# EAGLE design McPiFace-Pi4-V1.0 (EAGLE 7.4.0)
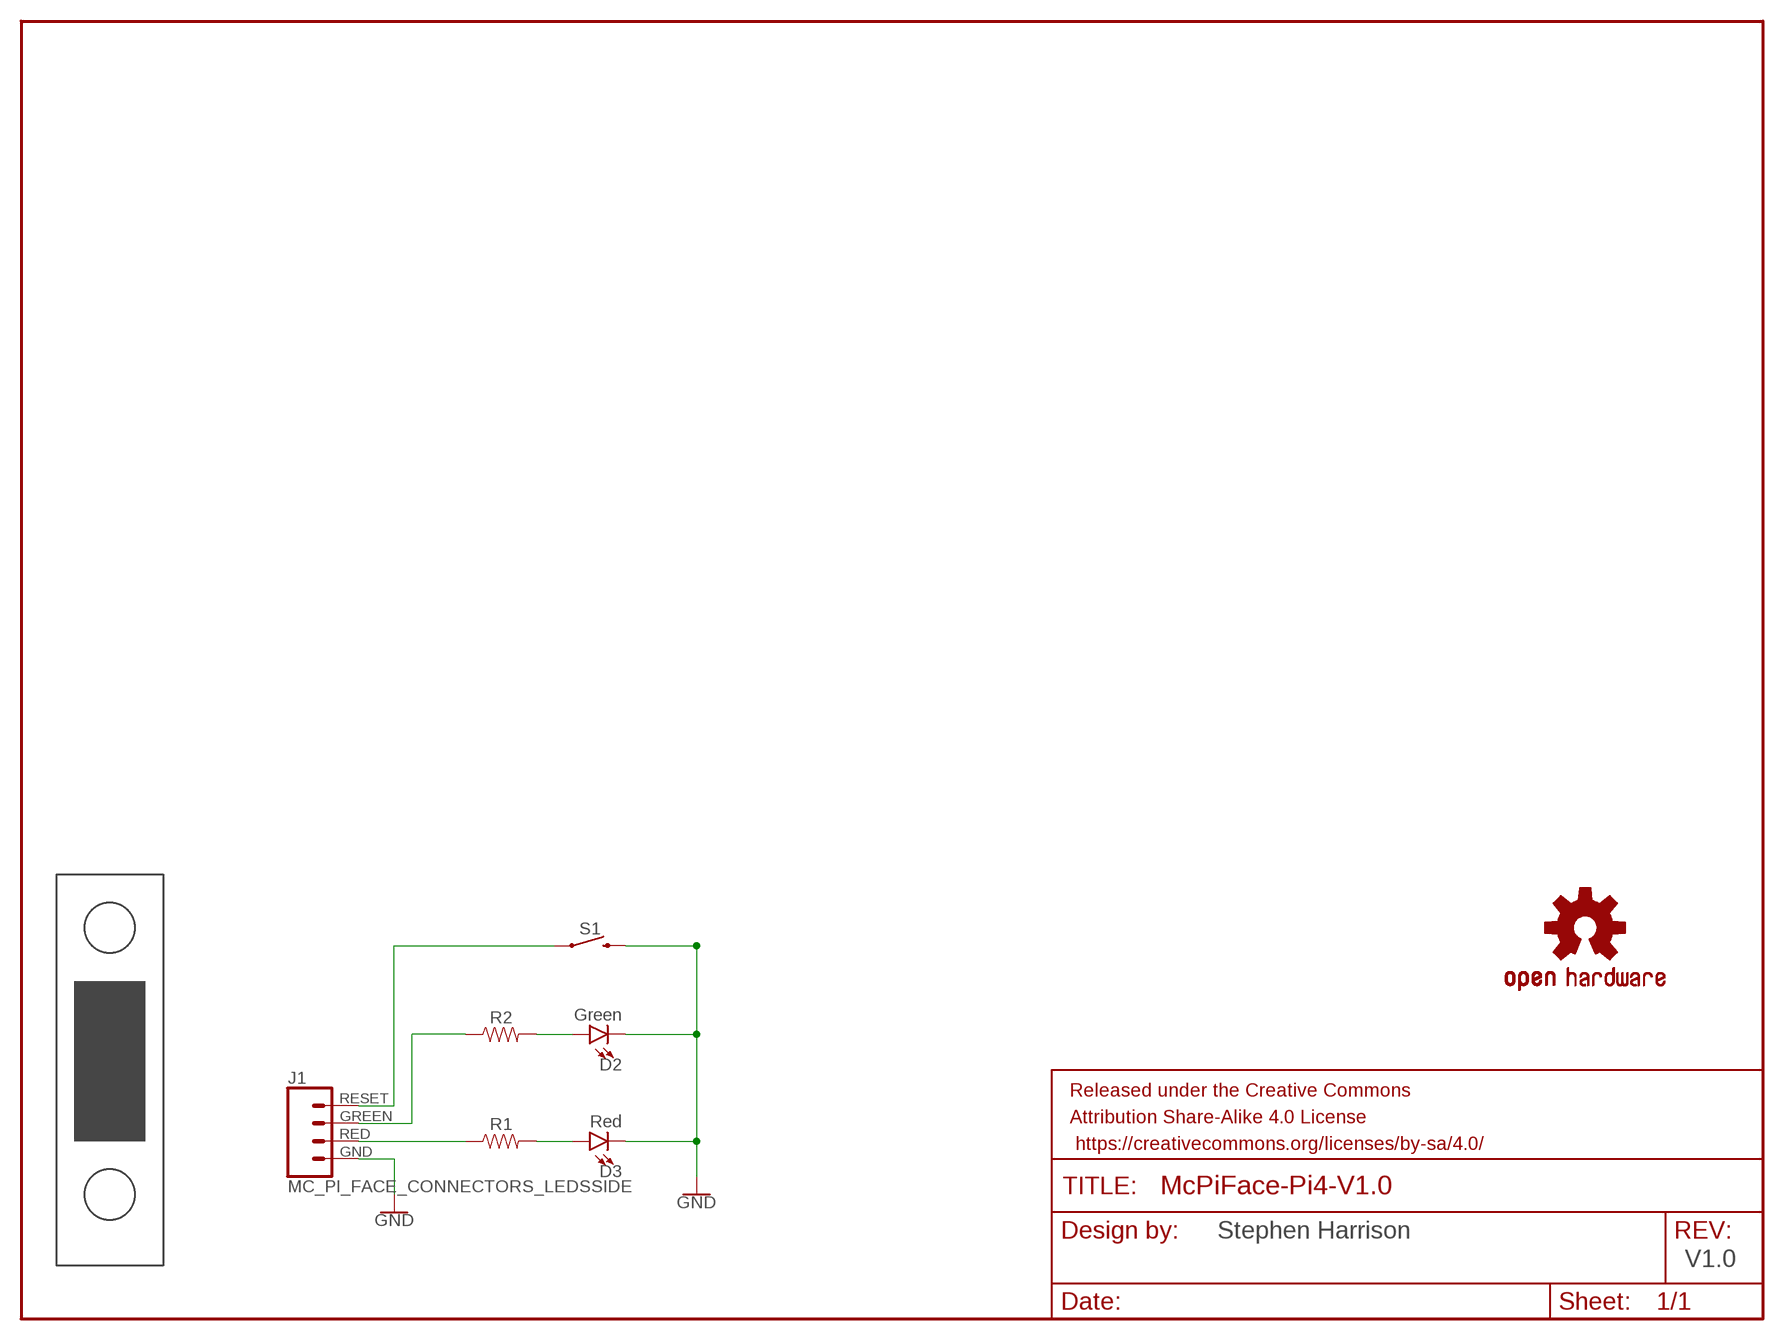
[diagram p0: schematic, sheet 1]

## Parts
D2  Green  LEDLED-1206-BOTTOM-2.0MM-GREEN  [LED-1206-BOTTOM-2.0MM]
D3  Red  LEDLED-1206-BOTTOM-2.0MM-RED  [LED-1206-BOTTOM-2.0MM]
FRAME1  FRAME-LETTER  [CREATIVE_COMMONS]
J1  MC_PI_FACE_CONNECTORS_LEDSSIDE  [JST-4-SH-1.0MM-SIDE]
LOGO1  OSHW-LOGOL  [OSHW-LOGO-L]
R1  RESISTOR0805  [0805]
R2  RESISTOR0805  [0805]
S1  MOMENTARY-SWITCH-SPSTTACKTILE_SWITCH_PTH_6.0MM_NO_TOP_RESIST  [TACTILE_SWITCH_PTH_6.0MM_NO_TOP_RESIST]
U$1  MC_PI_4_FACE_PANEL  [MC_PI_4_FACE]

## Nets
GND: D2.C D3.C J1.GND S1.3
N$3: D2.A R2.2
N$4: D3.A R1.2
N$5: J1.RED R1.1
N$6: J1.GREEN R2.1
N$7: J1.RESET S1.1

## Notes on the sheet
- Stephen Harrison
- V1.0

## Library data of the parts
D2 = ThingySticks:LED: LED (Generic) Standard schematic elements and footprints for 5mm, 3mm, 1206, and 0603 sized LEDs. Generic LEDs with no color specified.; COLOR: Green; FARNELL: 2217905; FORWARD_VOLTAGE: 2.1
D3 = ThingySticks:LED: LED (Generic) Standard schematic elements and footprints for 5mm, 3mm, 1206, and 0603 sized LEDs. Generic LEDs with no color specified.; COLOR: Hyper Red; FARNELL: 2217903; FORWARD_VOLTAGE: 1.95
FRAME1 = SparkFun-Aesthetics:FRAME-LETTER: Schematic Frame - Letter Standard 8.5x11 US Letter frame
J1 = McPiFace:MC_PI_FACE_CONNECTORS_LEDS; FARNELL: 1830839; MFG: SM04B-SRSS-TB(LF)(SN)
LOGO1 = SparkFun-Aesthetics:OSHW-LOGO: Open-Source Hardware (OSHW) Logo This logo indicates the piece of hardware it is found on incorporates a OSHW license and/or adheres to the definition of open source hardware found here: http://freedomdefined.org/OSHW
R1 R2 = SparkFun-Resistors:RESISTOR: Generic Resistor Package
S1 = ThingySticks:MOMENTARY-SWITCH-SPST: Momentary Switch (Pushbutton) - SPST Normally-open (NO) SPST momentary switches (buttons, pushbuttons). Variants PTH-12MM - 12mm square, through-hole Momentary Pushbutton Switch - 12mm Square <https://www.sparkfun.com/products/9190> (COM-09190) PTH-6.0MM, PTH-6.0MM-KIT - 6.0mm square, through-hole Mini Pushbutton Switch <https://www.sparkfun.com/products/97> (COM-00097) KIT package intended for soldering kit's - only one side of pads' copper is exposed. PTH-RIGHT-ANGLE-KIT - Right-angle, through-hole Right Angle Tactile Button <https://www.sparkfun.com/products/10791> - Used on SparkFun BigTime Watch Kit <https://www.sparkfun.com/products/11734> SMD-12MM - 12mm square, surface-mount Tactile Button - SMD (12mm) <https://www.sparkfun.com/products/12993> (COM-12993) Used on SparkFun PicoBoard <https://www.sparkfun.com/products/11888> SMD-4.5MM - 4.5mm Square Trackball Switch Used on SparkFun Blackberry Trackballer Breakout <https://www.sparkfun.com/products/13169> SMD-4.6MMX2.8MM - 4.60mm x 2.80mm, surface mount Used on SparkFun SAMD21 Mini Breakout <https://www.sparkfun.com/products/13664> SMD-5.2MM, SMD-5.2-REDUNDANT - 5.2mm square, surface-mount Mini Pushbutton Switch - SMD <https://www.sparkfun.com/products/8720> (COM-08720) Used on Arduino Pro Mini <https://www.sparkfun.com/products/11114> REDUNDANT package connects both switch circuits together SMD-6.0X3.5MM - 6.0 x 3.5mm, surface mount Momentary Reset Switch SMD <https://www.sparkfun.com/products/8229> (COM-08229) SMD-6.2MM-TALL - 6.2mm square, surface mount Tactile Button - SMD (6mm) <https://www.sparkfun.com/products/12992> Used on SparkFun Digital Sandbox <https://www.sparkfun.com/products/12651> SMD-RIGHT-ANGLE - Right-angle, surface mount Used on SparkFun Block for Intel® Edison - Arduino <https://www.sparkfun.com/products/13036>
U$1 = McPiFace:MC_PI_4_FACE_PANEL: PI Face Panels for Pi 4

## Board
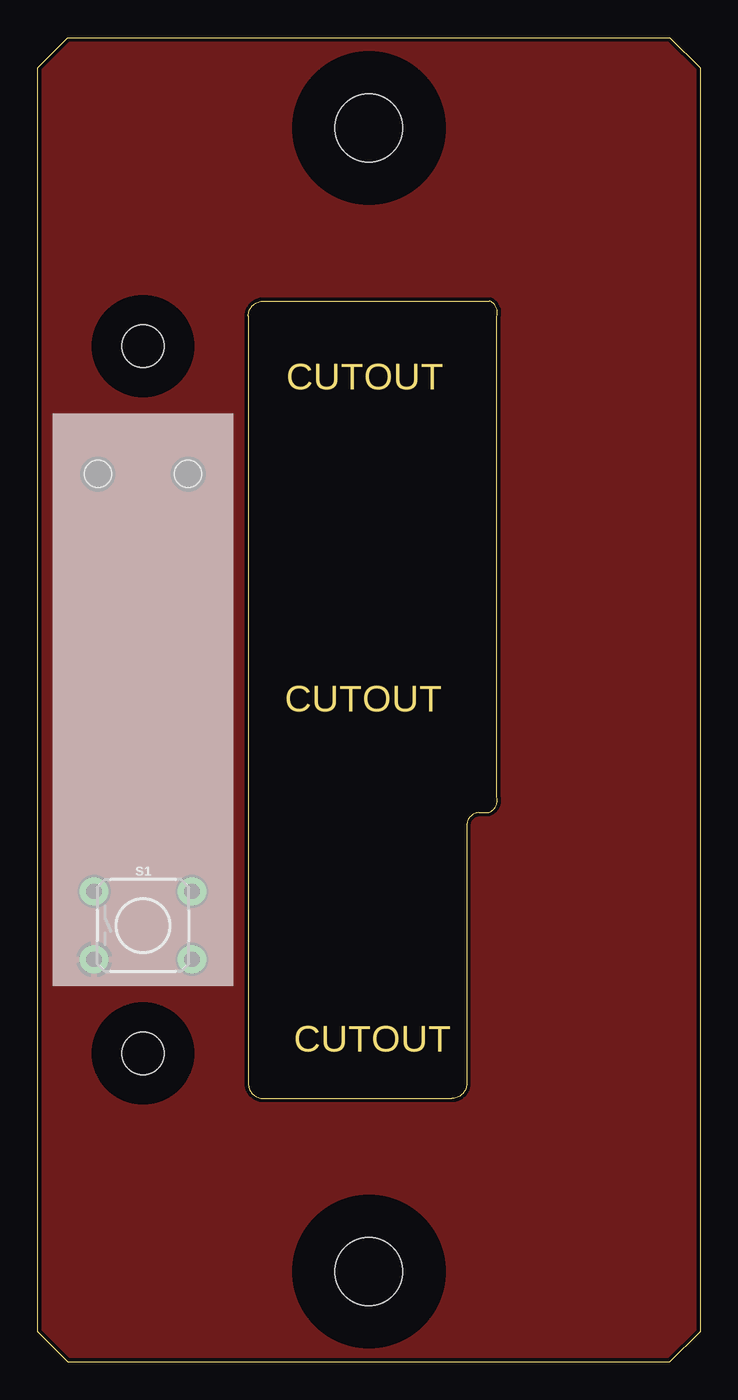
[diagram p1: board, top side]
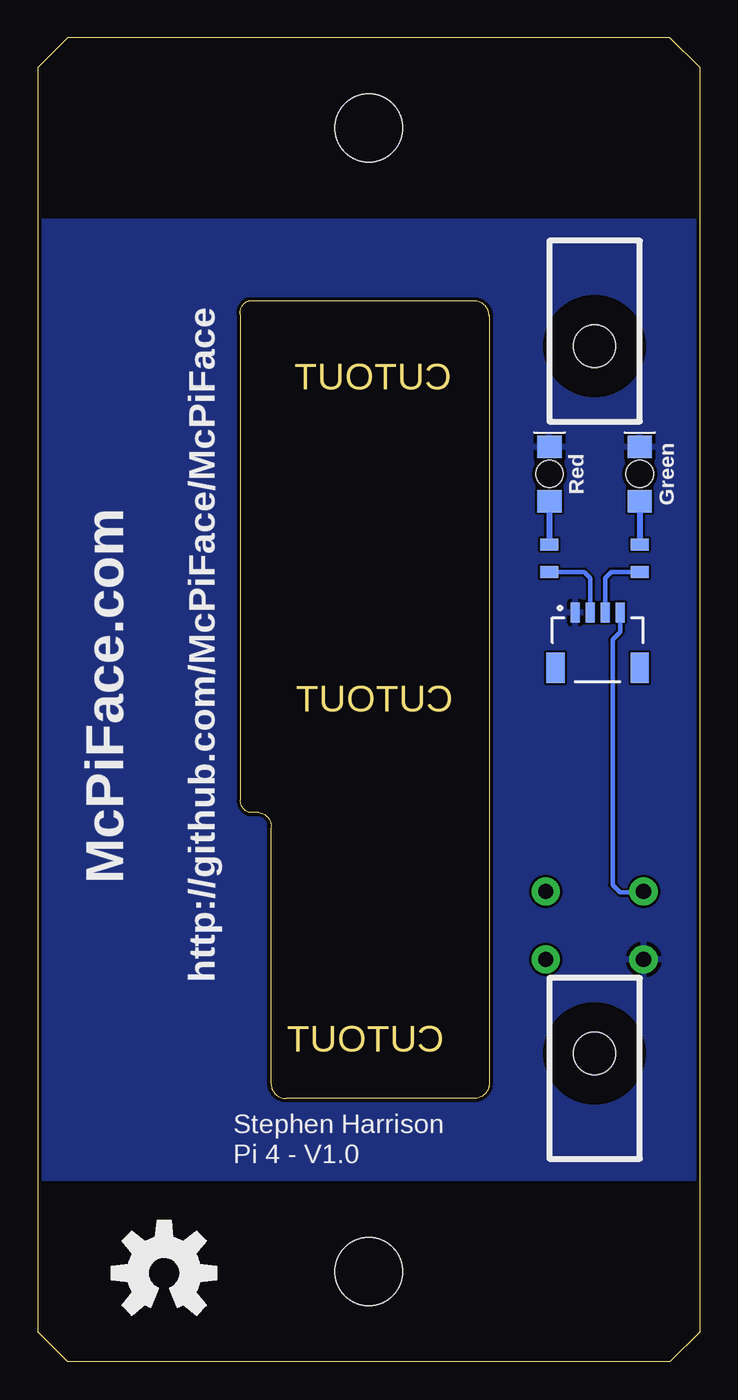
[diagram p2: board, bottom side, seen from below]

Size 44 x 88 mm. Coordinates in mm from the lower left corner, seen from the top.
Copper layers (1*16): Top 0.035mm / dielectric 1.5mm / Bottom 0.035mm
Design rules "dirt_cheap_dirty_boards.v1.1": minimum track width 6mil, minimum drill 12mil, track to track 6mil, track to pad 6mil, pad to pad 6mil, via to via 6mil, smd to smd 0mil, copper to edge 10mil, drill to drill 10mil, minimum pad ring 10mil, minimum via ring 6mil, stop-mask expansion 2mil, vias tented up to drill 25mil, thermal gap 10mil
tRestrict: area 17,77 to 27,87; area 17,1 to 27,11

### Footprints (pad centres in the part's own frame; a part is rotated, then mirrored left to right if it is on the bottom)
LED-1206-BOTTOM-2.0MM = smd 1.5 x 1.6: A -1.8,0; C 1.8,0 | hole 1.8: 0,0
JST-4-SH-1.0MM-SIDE = smd 0.6 x 1.35: GND -1.5,0; GREEN 0.5,0; RED -0.5,0; RESET 1.5,0 | smd 1.2 x 2: NC1 2.8,-3.675; NC2 -2.8,-3.675
0805 = smd 0.8 x 1.2: 1 -0.9,0; 2 0.9,0
TACTILE_SWITCH_PTH_6.0MM_NO_TOP_RESIST = drill 1.016 pad 1.88: 1 -3.251,2.261; 2 3.251,2.261; 3 -3.251,-2.261; 4 3.251,-2.261
MC_PI_4_FACE = hole 2.8: 7,20.5; 7,67.5 | hole 4.5: 22,6; 22,82

### Placement (x,y rotation side)
D2  4,59 90 bottom
D3  10,59 90 bottom
FRAME1  -3.8,-11.6 0 top  (outside the outline)
J1  6.8,49.8 0 bottom
LOGO1  35.6,5.9 0 bottom
R1  10,53.4 90 bottom
R2  4,53.4 90 bottom
S1  7,29 0 top
U$1  0,0 0 top

### Tracks (layer width: path | path; a pad name or v marks a point on that pad's centre or on a via)
GND
  pour Top: -1,88.5 45,88.5 45,-1 -1,-1
  pour Bottom: -1,88.5 45,88.5 45,-1 -1,-1
N$3
  Bottom 0.406: D2.A R2.2
N$4
  Bottom 0.406: D3.A R1.2
N$5
  Bottom 0.305: R1.1 7.7,52.5 7.3,52.1 J1.RED
N$6
  Bottom 0.305: R2.1 5.9,52.5 6.3,52.1 J1.GREEN
N$7
  Bottom 0.305: J1.RESET 5.3,48.5 5.8,48 5.8,31.7 5.3,31.2 3.81,31.2 S1.1

### Text on the board
bNames: http://github.com/McPiFace/McPiFace | McPiFace.com | Stephen Harrison | Pi 4 - V1.0
Document: Stephen Harrison